# EAGLE board 31813B (EAGLE 7.5.0), part 1 of 2
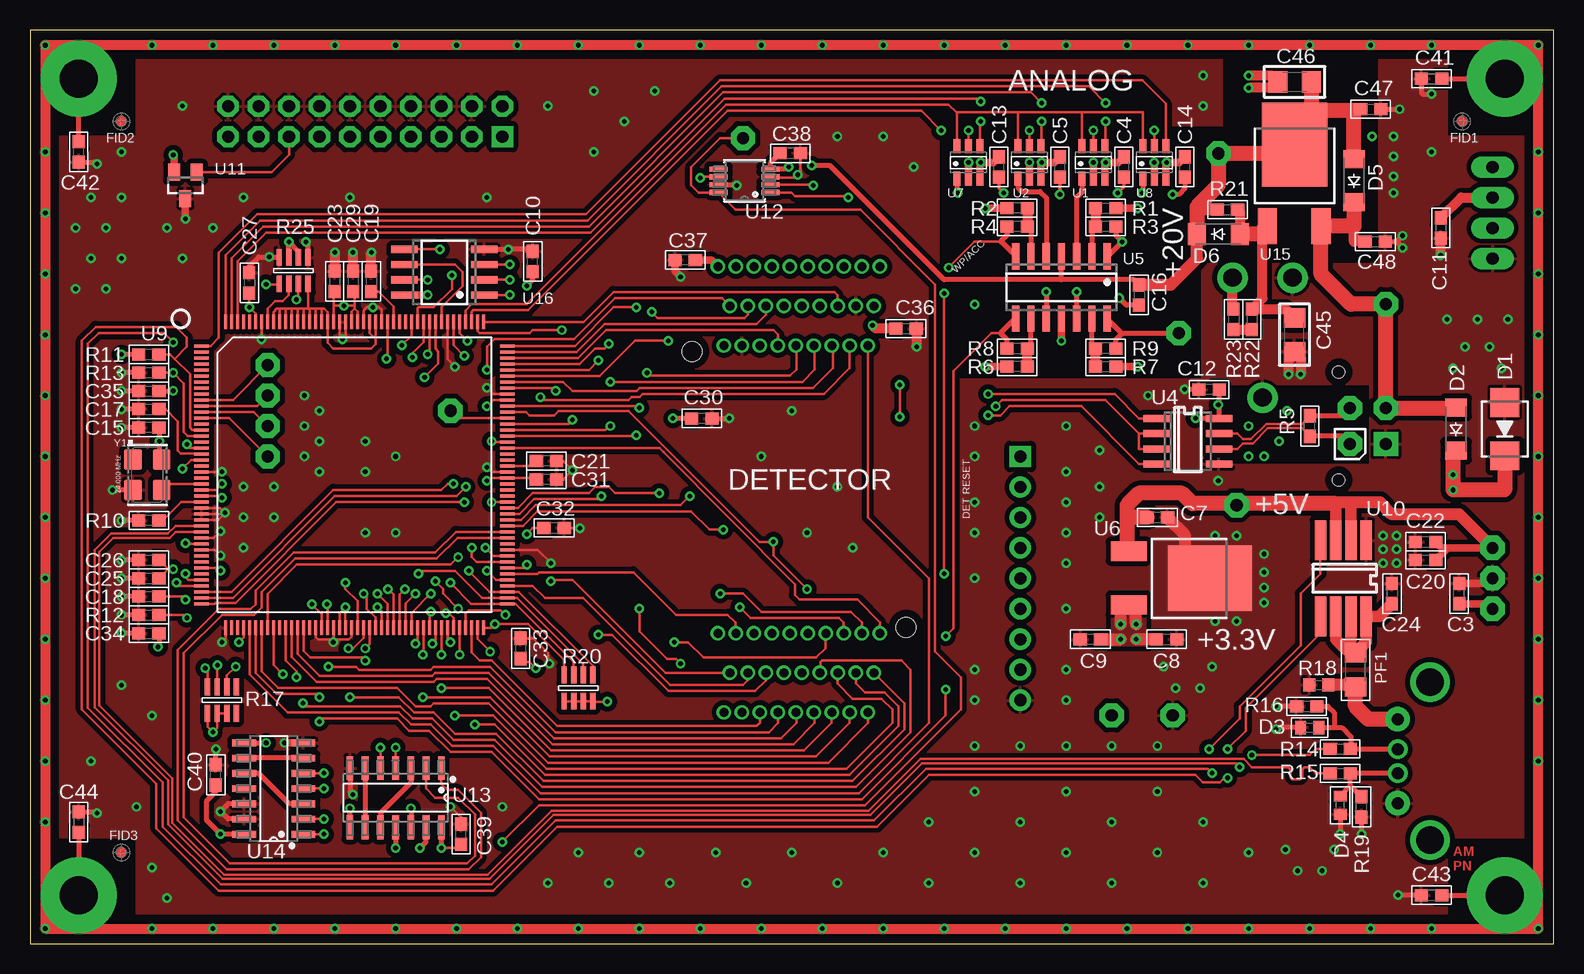
[diagram p2: board, top side]
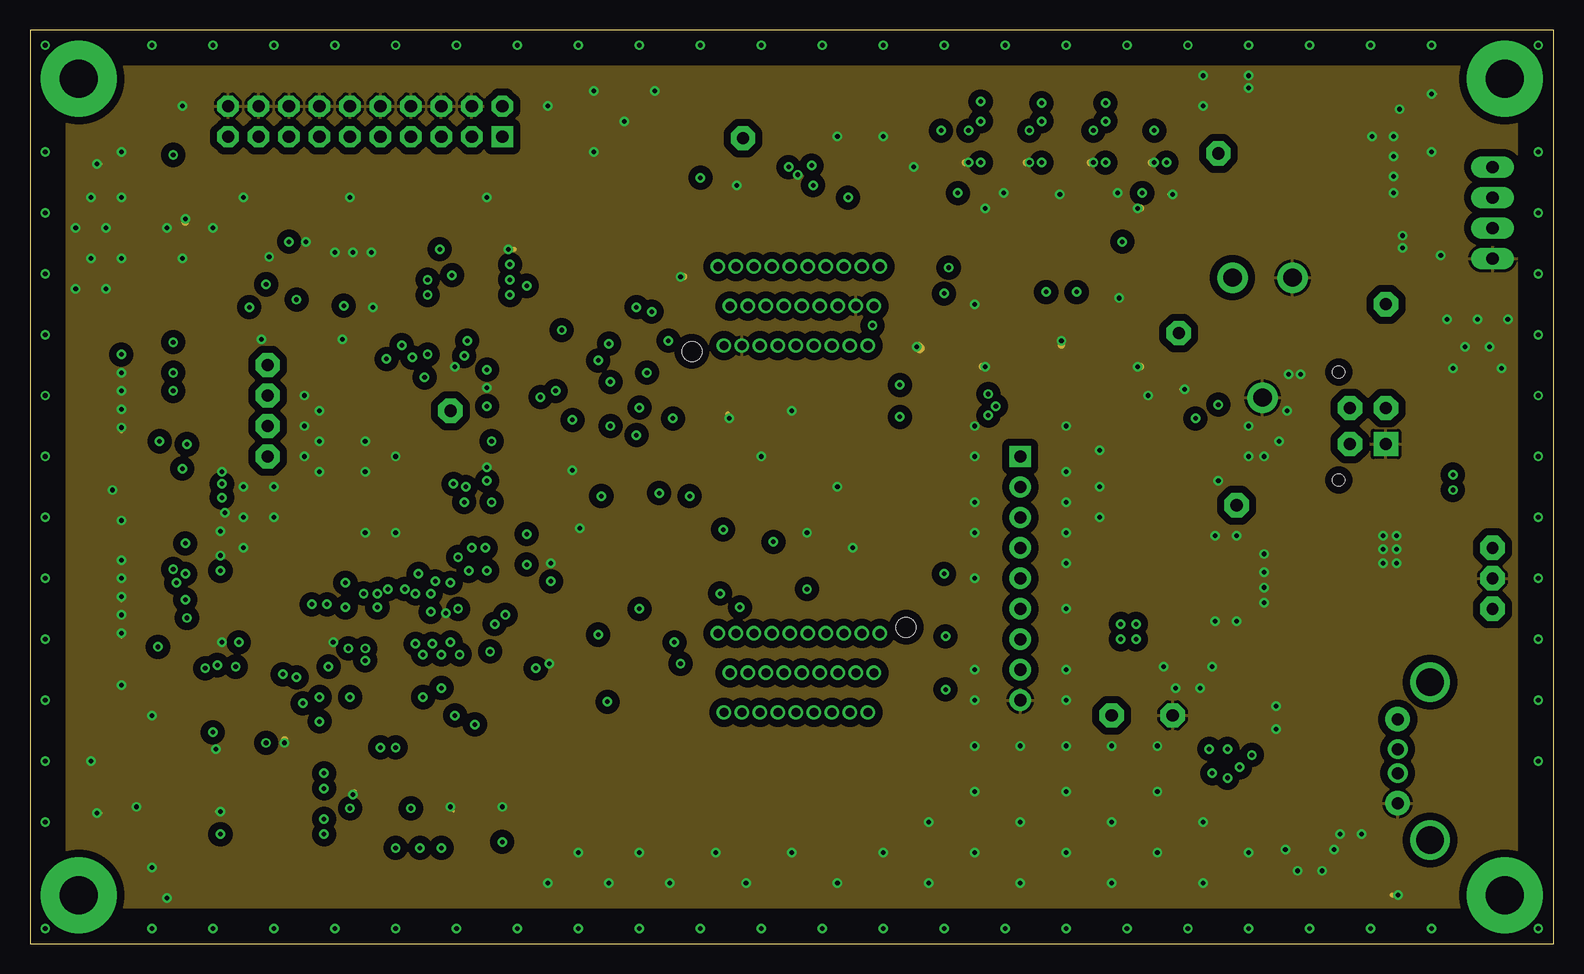
[diagram p3: board, inner layer Route2]
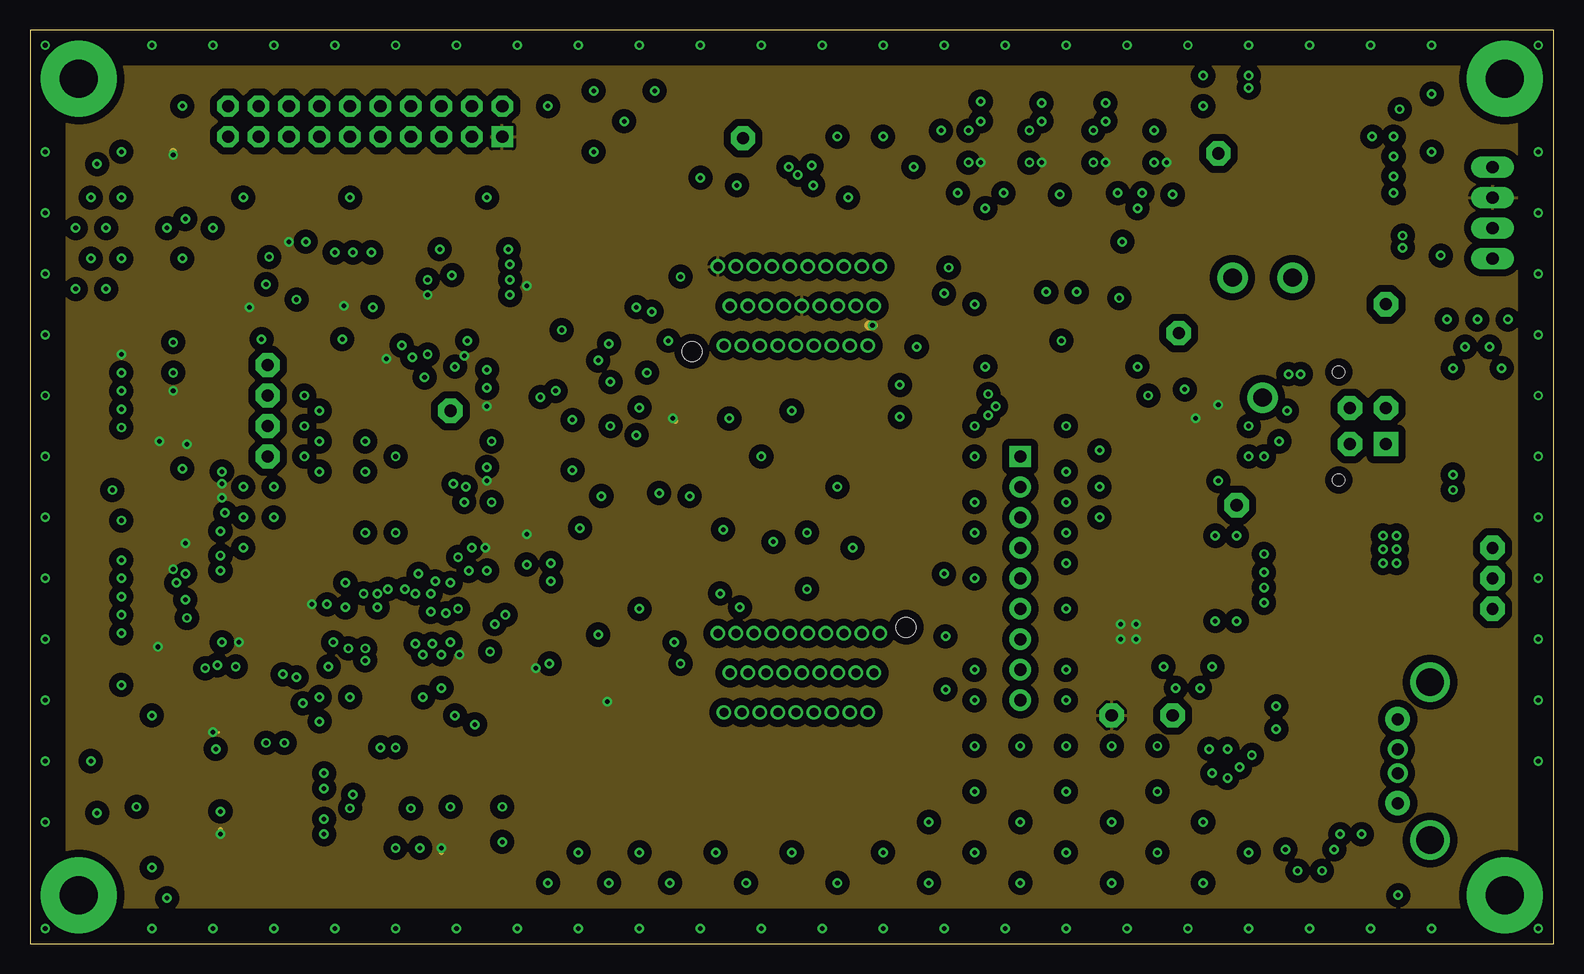
[diagram p4: board, inner layer Route15]
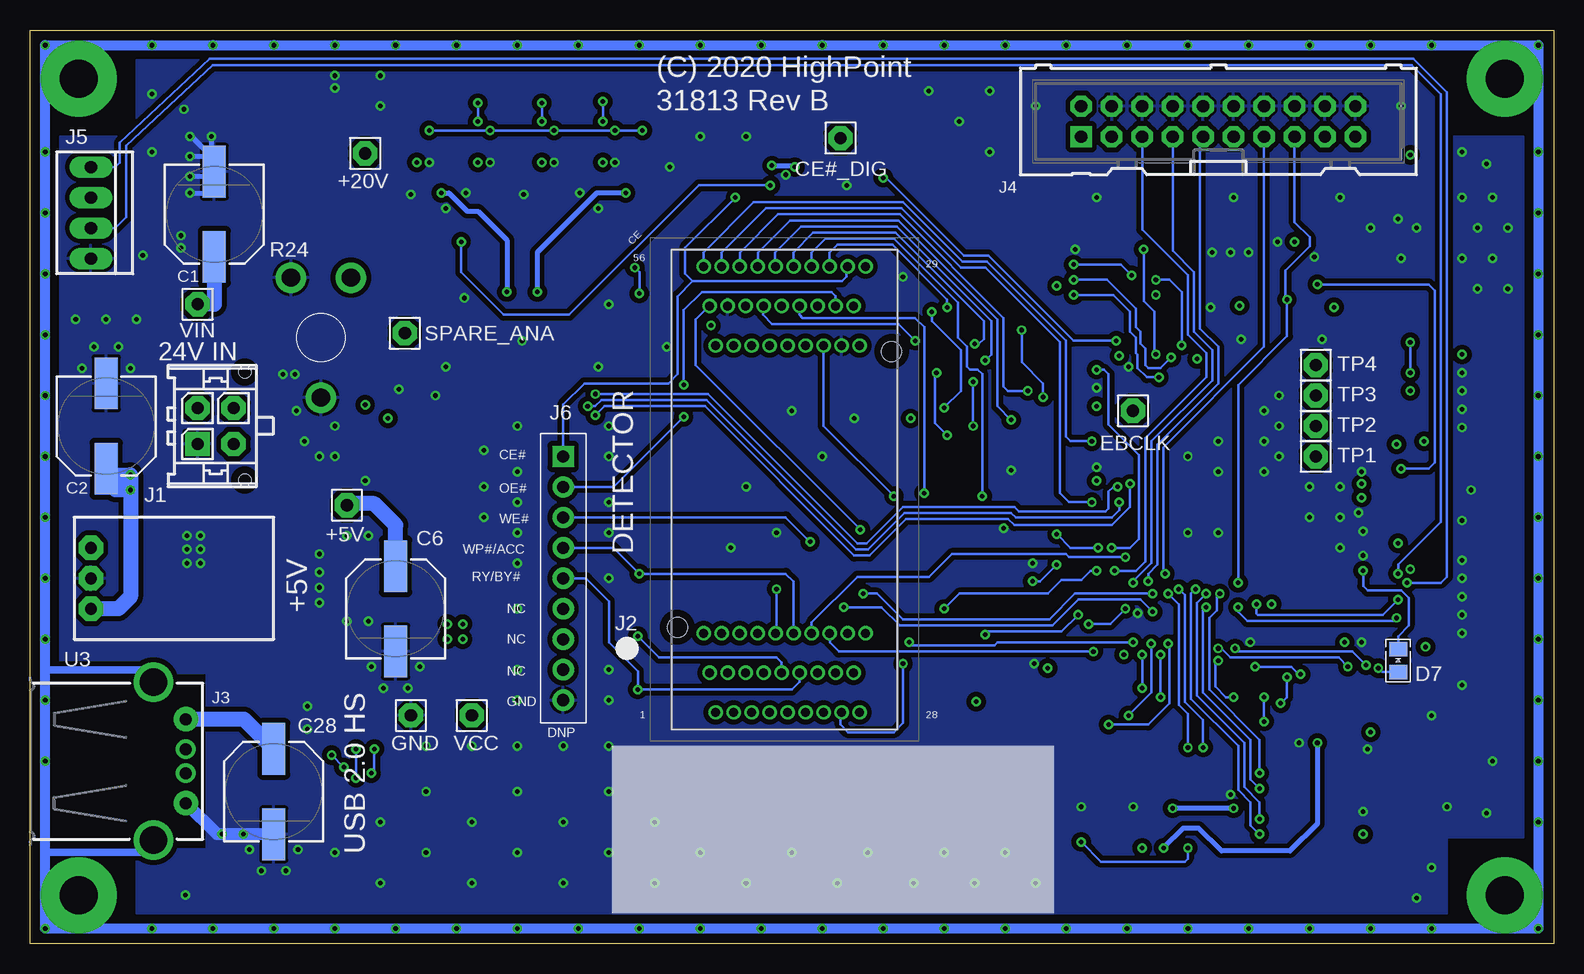
[diagram p5: board, bottom side, seen from below]

Size 127 x 76.2 mm. Coordinates in mm from the lower left corner, seen from the top.
Outline: 0,0 127,0 127,76.2 0,76.2 0,0
Copper layers (1*2+15*16): Top 0.035559375mm / dielectric 0.50038125mm / Route2 0.035559375mm / dielectric 0.50038125mm / Route15 0.035559375mm / dielectric 0.50038125mm / Bottom 0.035559375mm
Design rules "HPT 7X7 4 Layer 4pcb *": minimum track width 6mil, minimum drill 13mil, track to track 6mil, track to pad 6mil, pad to pad 6mil, via to via 6mil, smd to smd 6mil, copper to edge 24mil, drill to drill 15mil, minimum pad ring 0mil, minimum via ring 8mil, stop-mask expansion 6mil, vias tented up to drill 16mil, thermal gap 10mil
Net classes: 1 diff pairs: width 0.203 mm

## Footprints (pad centres in the part's own frame; a part is rotated, then mirrored left to right if it is on the bottom)
TP8040 = drill 1.016 pad 2.032 octagon: 1 0,0
CSV-E/F = smd 4.318 x 1.93: + -3.556,0; - 3.556,0
0603 = smd 1.1 x 1: 1 -0.85,0; 2 0.85,0
C1206 = smd 1.6 x 1.8: 1 -1.4,0; 2 1.4,0
SOD-123_MINI-SMA = smd 1.5 x 1.8: A 1.8,0; C -1.8,0
SMB = smd 2.4 x 2.4: A 2.223,0; C -2.223,0
PGB-0603 = smd 0.9 x 1.1: 1 -0.762,0; 2 0.762,0
D0805 = smd 1.2 x 1.5: A 0.953,0; C -0.953,0
43045-0412 = drill 1.02 pad 2.032 square: 1 1.5,0 | drill 1.02 pad 2.032 octagon: 2 -1.5,0; 3 1.5,3; 4 -1.5,3 | hole 1.02: 4.5,3.94; -4.5,3.94
IC1910562003 = drill 0.75 pad 1.2: 1 6.6,1; 2 3.3,0.5; 3 0,0; 4 6.6,-0.5; 5 3.3,-1; 6 0,-1.5; 7 6.6,-2; 8 3.3,-2.5; 9 0,-3; 10 6.6,-3.5; 11 3.3,-4; 12 0,-4.5; 13 6.6,-5; 14 3.3,-5.5; 15 0,-6; 16 6.6,-6.5; 17 3.3,-7; 18 0,-7.5; 19 6.6,-8; 20 3.3,-8.5; 21 0,-9; 22 6.6,-9.5; 23 3.3,-10; 24 0,-10.5; 25 6.6,-11; 26 3.3,-11.5; 27 0,-12; 28 6.6,-12.5; 29 37.18,-12.5; 30 30.58,-12; 31 33.88,-11.5; 32 37.18,-11; 33 30.58,-10.5; 34 33.88,-10; 35 37.18,-9.5; 36 30.58,-9; 37 33.88,-8.5; 38 37.18,-8; 39 30.58,-7.5; 40 33.88,-7; 41 37.18,-6.5; 42 30.58,-6; 43 33.88,-5.5; 44 37.18,-5; 45 30.58,-4.5; 46 33.88,-4; 47 37.18,-3.5; 48 30.58,-3; 49 33.88,-2.5; 50 37.18,-2; 51 30.58,-1.5; 52 33.88,-1; 53 37.18,-0.5; 54 30.58,0; 55 33.88,0.5; 56 37.18,1 | hole 1.65: 7.09,3.175; 30.09,-14.675
USB = drill 1 pad 2.032: 1 -3.5,12.99; 4 3.5,12.99 | drill 1 pad 1.651: 2 -1,12.99; 3 1,12.99 | drill 2.286 pad 3.302: S1 -6.579,10.287; S2 6.579,10.287
ML20 = drill 1.016 pad 1.778 square: 1 -11.43,-1.27 | drill 1.016 pad 1.778 octagon: 2 -11.43,1.27; 3 -8.89,-1.27; 4 -8.89,1.27; 5 -6.35,-1.27; 6 -6.35,1.27; 7 -3.81,-1.27; 8 -3.81,1.27; 9 -1.27,-1.27; 10 -1.27,1.27; 11 1.27,-1.27; 12 1.27,1.27; 13 3.81,-1.27; 14 3.81,1.27; 15 6.35,-1.27; 16 6.35,1.27; 17 8.89,-1.27; 18 8.89,1.27; 19 11.43,-1.27; 20 11.43,1.27
MTA04-100 = drill 1.016 pad 1.778 long: 1 3.81,0; 2 1.27,0; 3 -1.27,0; 4 -3.81,0
9P-100 = drill 1.016 pad 1.778 square: 1 -10.16,0 | drill 1.016 pad 1.778: 2 -7.62,0; 3 -5.08,0; 4 -2.54,0; 5 0,0; 6 2.54,0; 7 5.08,0; 8 7.62,0; 9 10.16,0
MNT-125 = drill 3.175 pad 6.35: 1 0,0
F1206 = smd 1.6 x 1.803: 1 -1.429,0; 2 1.429,0
RNET-4R-38V = smd 0.45 x 1.4: 1 -1.2,-1.1; 2 -0.4,-1.1; 3 0.4,-1.1; 4 1.2,-1.1; 5 1.2,1.1; 6 0.4,1.1; 7 -0.4,1.1; 8 -1.2,1.1
R0603 = smd 1 x 1.1: 1 -0.794,0; 2 0.794,0
POT-V10 = drill 1.524 pad 2.54: 1 -2.5,-5; 2 2.5,-5; 3 0,5
SOT23-6 = smd 0.6 x 1.1: 1 -0.95,-1.35; 2 0,-1.35; 3 0.95,-1.35; 4 0.95,1.35; 5 0,1.35; 6 -0.95,1.35
PS-OKI-78SR = drill 0.991 pad 2.032 octagon: 1 -2.54,0; 2 0,0; 3 2.54,0
SOIC-08-150 = smd 0.6 x 2.2: 1 -1.905,-2.6; 2 -0.635,-2.6; 3 0.635,-2.6; 4 1.905,-2.6; 5 1.905,2.6; 6 0.635,2.6; 7 -0.635,2.6; 8 -1.905,2.6
SO14 = smd 0.6 x 2.2: 1 -3.81,-2.6; 2 -2.54,-2.6; 3 -1.27,-2.6; 4 0,-2.6; 5 1.27,-2.6; 6 2.54,-2.6; 7 3.81,-2.6; 8 3.81,2.6; 9 2.54,2.6; 10 1.27,2.6; 11 0,2.6; 12 -1.27,2.6; 13 -2.54,2.6; 14 -3.81,2.6
DPAK = smd 1.6 x 2.997: 1 -2.261,-4.928; 3 2.21,-4.928 | smd 5.452 x 7: 4 0,1.853
LQFP176 = smd 0.25 x 1.2: 1 -10.75,-12.75; 2 -10.25,-12.75; 3 -9.75,-12.75; 4 -9.25,-12.75; 5 -8.75,-12.75; 6 -8.25,-12.75; 7 -7.75,-12.75; 8 -7.25,-12.75; 9 -6.75,-12.75; 10 -6.25,-12.75; 11 -5.75,-12.75; 12 -5.25,-12.75; 13 -4.75,-12.75; 14 -4.25,-12.75; 15 -3.75,-12.75; 16 -3.25,-12.75; 17 -2.75,-12.75; 18 -2.25,-12.75; 19 -1.75,-12.75; 20 -1.25,-12.75; 21 -0.75,-12.75; 22 -0.25,-12.75; 23 0.25,-12.75; 24 0.75,-12.75; 25 1.25,-12.75; 26 1.75,-12.75; 27 2.25,-12.75; 28 2.75,-12.75; 29 3.25,-12.75; 30 3.75,-12.75; 31 4.25,-12.75; 32 4.75,-12.75; 33 5.25,-12.75; 34 5.75,-12.75; 35 6.25,-12.75; 36 6.75,-12.75; 37 7.25,-12.75; 38 7.75,-12.75; 39 8.25,-12.75; 40 8.75,-12.75; 41 9.25,-12.75; 42 9.75,-12.75; 43 10.25,-12.75; 44 10.75,-12.75; 89 10.75,12.75; 90 10.25,12.75; 91 9.75,12.75; 92 9.25,12.75; 93 8.75,12.75; 94 8.25,12.75; 95 7.75,12.75; 96 7.25,12.75; 97 6.75,12.75; 98 6.25,12.75; 99 5.75,12.75; 100 5.25,12.75; 101 4.75,12.75; 102 4.25,12.75; 103 3.75,12.75; 104 3.25,12.75; 105 2.75,12.75; 106 2.25,12.75; 107 1.75,12.75; 108 1.25,12.75; 109 0.75,12.75; 110 0.25,12.75; 111 -0.25,12.75; 112 -0.75,12.75; 113 -1.25,12.75; 114 -1.75,12.75; 115 -2.25,12.75; 116 -2.75,12.75; 117 -3.25,12.75; 118 -3.75,12.75; 119 -4.25,12.75; 120 -4.75,12.75; 121 -5.25,12.75; 122 -5.75,12.75; 123 -6.25,12.75; 124 -6.75,12.75; 125 -7.25,12.75; 126 -7.75,12.75; 127 -8.25,12.75; 128 -8.75,12.75; 129 -9.25,12.75; 130 -9.75,12.75; 131 -10.25,12.75; 132 -10.75,12.75 | smd 1.2 x 0.25: 45 12.75,-10.75; 46 12.75,-10.25; 47 12.75,-9.75; 48 12.75,-9.25; 49 12.75,-8.75; 50 12.75,-8.25; 51 12.75,-7.75; 52 12.75,-7.25; 53 12.75,-6.75; 54 12.75,-6.25; 55 12.75,-5.75; 56 12.75,-5.25; 57 12.75,-4.75; 58 12.75,-4.25; 59 12.75,-3.75; 60 12.75,-3.25; 61 12.75,-2.75; 62 12.75,-2.25; 63 12.75,-1.75; 64 12.75,-1.25; 65 12.75,-0.75; 66 12.75,-0.25; 67 12.75,0.25; 68 12.75,0.75; 69 12.75,1.25; 70 12.75,1.75; 71 12.75,2.25; 72 12.75,2.75; 73 12.75,3.25; 74 12.75,3.75; 75 12.75,4.25; 76 12.75,4.75; 77 12.75,5.25; 78 12.75,5.75; 79 12.75,6.25; 80 12.75,6.75; 81 12.75,7.25; 82 12.75,7.75; 83 12.75,8.25; 84 12.75,8.75; 85 12.75,9.25; 86 12.75,9.75; 87 12.75,10.25; 88 12.75,10.75; 133 -12.75,10.75; 134 -12.75,10.25; 135 -12.75,9.75; 136 -12.75,9.25; 137 -12.75,8.75; 138 -12.75,8.25; 139 -12.75,7.75; 140 -12.75,7.25; 141 -12.75,6.75; 142 -12.75,6.25; 143 -12.75,5.75; 144 -12.75,5.25; 145 -12.75,4.75; 146 -12.75,4.25; 147 -12.75,3.75; 148 -12.75,3.25; 149 -12.75,2.75; 150 -12.75,2.25; 151 -12.75,1.75; 152 -12.75,1.25; 153 -12.75,0.75; 154 -12.75,0.25; 155 -12.75,-0.25; 156 -12.75,-0.75; 157 -12.75,-1.25; 158 -12.75,-1.75; 159 -12.75,-2.25; 160 -12.75,-2.75; 161 -12.75,-3.25; 162 -12.75,-3.75; 163 -12.75,-4.25; 164 -12.75,-4.75; 165 -12.75,-5.25; 166 -12.75,-5.75; 167 -12.75,-6.25; 168 -12.75,-6.75; 169 -12.75,-7.25; 170 -12.75,-7.75; 171 -12.75,-8.25; 172 -12.75,-8.75; 173 -12.75,-9.25; 174 -12.75,-9.75; 175 -12.75,-10.25; 176 -12.75,-10.75
SOIC-8-SPECIAL = smd 0.965 x 3.302: 1 -1.905,-3.175; 2 -0.635,-3.175; 3 0.635,-3.175; 4 1.905,-3.175; 5 1.905,3.175; 6 0.635,3.175; 7 -0.635,3.175; 8 -1.905,3.175
SOT23 = smd 1 x 1.4: 1 -0.95,-1.1; 2 0.95,-1.1; 3 0,1.1
RM_8_ADI = smd 1.524 x 0.432: 1 -2.172,0.975; 2 -2.172,0.325; 3 -2.172,-0.325; 4 -2.172,-0.975; 5 2.172,-0.975; 6 2.172,-0.325; 7 2.172,0.325; 8 2.172,0.975
D14 = smd 1.981 x 0.559: 1 -2.464,3.81; 2 -2.464,2.54; 3 -2.464,1.27; 4 -2.464,0; 5 -2.464,-1.27; 6 -2.464,-2.54; 7 -2.464,-3.81; 8 2.464,-3.81; 9 2.464,-2.54; 10 2.464,-1.27; 11 2.464,0; 12 2.464,1.27; 13 2.464,2.54; 14 2.464,3.81
SO08-JB = smd 0.6 x 2.2: 1 -1.905,-3.33; 2 -0.635,-3.33; 3 0.635,-3.33; 4 1.905,-3.33; 5 1.905,3.33; 6 0.635,3.33; 7 -0.635,3.33; 8 -1.905,3.33
ASFL1 = smd 1.7 x 1.5: 1 -1.27,-1.2; 2 1.27,-1.2; 3 1.27,1.2; 4 -1.27,1.2

## Placement (x,y rotation side)
+5V  TP  [TP8040]  100.58,36.58 0 bottom
+20V  TP  [TP8040]  99.06,65.91 0 bottom
C1  100 uF  [CSV-E/F]  111.63,60.83 90 bottom
C2  100 uF  [CSV-E/F]  120.65,43.18 90 bottom
C3  0.1 uF  [0603]  119.13,29.21 90 top
C4  10 uF  [0603]  91.19,64.77 90 top
C5  10 uF  [0603]  85.85,64.77 90 top
C6  100 uF  [CSV-E/F]  96.52,27.94 270 bottom
C7  0.1 uF  [0603]  93.98,35.56 0 top
C8  10 uF  [0603]  94.74,25.4 0 top
C9  10 uF  [0603]  88.39,25.4 180 top
C10  10 uF  [0603]  41.91,56.9 90 top
C11  10 uF  [0603]  117.6,59.69 270 top
C12  0.1 uF  [0603]  98.3,46.23 180 top
C13  10 uF  [0603]  80.77,64.77 90 top
C14  10 uF  [0603]  96.27,64.77 90 top
C15  0.1 uF  [0603]  9.91,43.05 180 top
C16  0.1 uF  [0603]  92.46,54.1 270 top
C17  10 uF  [0603]  9.91,44.58 0 top
C18  0.1 uF  [0603]  9.91,28.96 0 top
C19  0.1 uF  [0603]  28.45,55.24 270 top
C20  10 uF  [0603]  116.33,32 0 top
C21  10 uF  [0603]  43.05,40.26 180 top
C22  10 uF  [0603]  116.33,33.53 0 top
C23  0.1 uF  [0603]  25.4,55.24 270 top
C24  0.1 uF  [0603]  113.54,29.21 270 top
C25  10 uF  [0603]  9.91,30.48 0 top
C26  10 uF  [0603]  9.91,32 0 top
C27  0.1 uF  [0603]  18.29,55.12 270 top
C28  100 uF  [CSV-E/F]  106.68,12.7 270 bottom
C29  10 uF  [0603]  26.92,55.24 270 top
C30  10 uF  [0603]  56.01,43.81 180 top
C31  0.1 uF  [0603]  43.05,38.73 180 top
C32  0.1 uF  [0603]  43.69,34.67 180 top
C33  10 uF  [0603]  40.89,24.64 270 top
C34  10 uF  [0603]  9.91,25.91 0 top
C35  0.1 uF  [0603]  9.91,46.1 0 top
C36  0.1 uF  [0603]  73.03,51.31 0 top
C37  10 uF  [0603]  54.61,57.02 180 top
C38  0.1 uF  [0603]  63.37,65.91 180 top
C39  10 uF  [0603]  35.94,9.14 90 top
C40  10 uF  [0603]  15.49,14.1 90 top
C41  0.1 uF  [0603]  116.84,72.14 0 top
C42  0.1 uF  [0603]  4.06,66.04 90 top
C43  0.1 uF  [0603]  116.84,4.06 0 top
C44  0.1 uF  [0603]  4.06,10.16 270 top
C45  22 uF  [C1206]  105.41,50.8 90 top
C46  22 uF  [C1206]  105.41,71.88 0 top
C47  0.1 uF  [0603]  111.76,69.6 0 top
C48  0.1 uF  [0603]  112.14,58.55 0 top
CE#_DIG  TP  [TP8040]  59.44,67.18 0 bottom
D1  DIODE  [SOD-123_MINI-SMA]  118.87,42.93 90 top
D2  36 V  [SMB]  122.94,42.93 90 top
D3  PGB-0603  [PGB-0603]  106.68,18.03 0 top
D4  PGB-0603  [PGB-0603]  109.22,11.56 90 top
D5  DIODE  [SOD-123_MINI-SMA]  110.36,63.63 90 top
D6  DIODE  [SOD-123_MINI-SMA]  99.06,59.18 0 top
D7  LED0805  [D0805]  12.95,23.62 270 bottom
EBCLK  TP  [TP8040]  35.05,44.45 0 bottom
FID1  [G8]  119.38,68.58 0 top
FID2  [G8]  7.62,68.58 0 top
FID3  [G8]  7.62,7.62 0 top
GND  TP  [TP8040]  95.25,19.05 0 bottom
J1  [43045-0412]  113.03,43.18 270 bottom
J2  IC191-0562-003  [IC1910562003]  69.85,19.3 90 bottom
J3  [USB]  127,15.24 270 bottom
J4  [ML20]  27.94,68.58 0 bottom
J5  [MTA04-100]  121.92,60.96 270 bottom
J6  DNP  [9P-100]  82.55,30.48 270 bottom
M1  MNT-125  [MNT-125]  4.06,4.06 0 top
M2  MNT-125  [MNT-125]  4.06,72.14 0 top
M3  MNT-125  [MNT-125]  122.94,72.14 0 top
M4  MNT-125  [MNT-125]  122.94,4.06 0 top
PF1  0.5 A  [F1206]  110.49,22.86 270 top
R1  1.5K  [0603]  89.66,61.34 0 top
R2  1.5K  [0603]  82.3,61.34 180 top
R3  10K  [0603]  89.66,59.82 180 top
R4  10K  [0603]  82.3,59.82 180 top
R5  120  [0603]  106.68,43.18 90 top
R6  1.5K  [0603]  82.3,48.13 180 top
R7  1.5K  [0603]  89.66,48.13 0 top
R8  10K  [0603]  82.3,49.66 0 top
R9  10K  [0603]  89.66,49.66 180 top
R10  2.2 K 1%  [0603]  9.91,35.31 180 top
R11  47 K  [0603]  9.91,49.15 0 top
R12  10 K  [0603]  9.91,27.43 0 top
R13  47 K  [0603]  9.91,47.62 0 top
R14  22.1  [0603]  109.22,16.26 0 top
R15  22.1  [0603]  109.22,14.22 0 top
R16  15 K  [0603]  106.43,19.81 0 top
R17  4.7 K  [RNET-4R-38V]  16,20.32 0 top
R18  MOV 12V  [R0603]  107.44,21.59 180 top
R19  15 K  [0603]  111,11.43 90 top
R20  4.7 K  [RNET-4R-38V]  45.72,21.34 180 top
R21  1K  [0603]  99.82,61.21 0 top
R22  10K  [0603]  101.85,52.07 270 top
R23  4.7K  [0603]  100.33,52.07 270 top
R24  1K  [POT-V10]  102.74,50.55 180 bottom
R25  4.7 K  [RNET-4R-38V]  21.97,56.13 0 top
SPARE_ANA  TP  [TP8040]  95.76,50.93 0 bottom
TP1  TP  [TP8040]  19.81,40.64 0 bottom
TP2  TP  [TP8040]  19.81,43.18 0 bottom
TP3  TP  [TP8040]  19.81,45.72 0 bottom
TP4  TP  [TP8040]  19.81,48.26 0 bottom
U1  DAC121  [SOT23-6]  88.65,65.15 0 top
U2  DAC121  [SOT23-6]  83.31,65.15 0 top
U3  OKI-78SR-5  [PS-OKI-78SR]  121.92,30.48 90 bottom
U4  SN65HVD12D  [SOIC-08-150]  96.52,41.91 270 top
U5  TLV9304IDR  [SO14]  85.98,54.74 180 top
U6  LD29080T  [DPAK]  96.52,30.48 270 top
U7  DAC121  [SOT23-6]  78.23,65.15 0 top
U8  DAC121  [SOT23-6]  93.73,65.15 0 top
U9  S7G2  [LQFP176]  27.05,39.12 270 top
U10  TPS2051  [SOIC-8-SPECIAL]  109.47,30.48 180 top
U11  MCP120  [SOT23]  12.95,63.25 180 top
U12  ADG5419BRMZ  [RM_8_ADI]  59.56,63.63 180 top
U13  SN74ALVC08D  [D14]  30.48,12.19 270 top
U14  SN74ALVC08D  [D14]  20.32,12.95 180 top
U15  LM317M  [DPAK]  105.41,64.77 0 top
U16  W25Q128FV  [SO08-JB]  34.54,56.01 90 top
VCC  TP  [TP8040]  90.17,19.05 0 bottom
VIN  TP  [TP8040]  113.03,53.34 0 bottom
Y1  24.000 MHz  [ASFL1]  9.78,39.12 270 top